# EAGLE schematic basic_schematic_input (EAGLE 9.6.2)
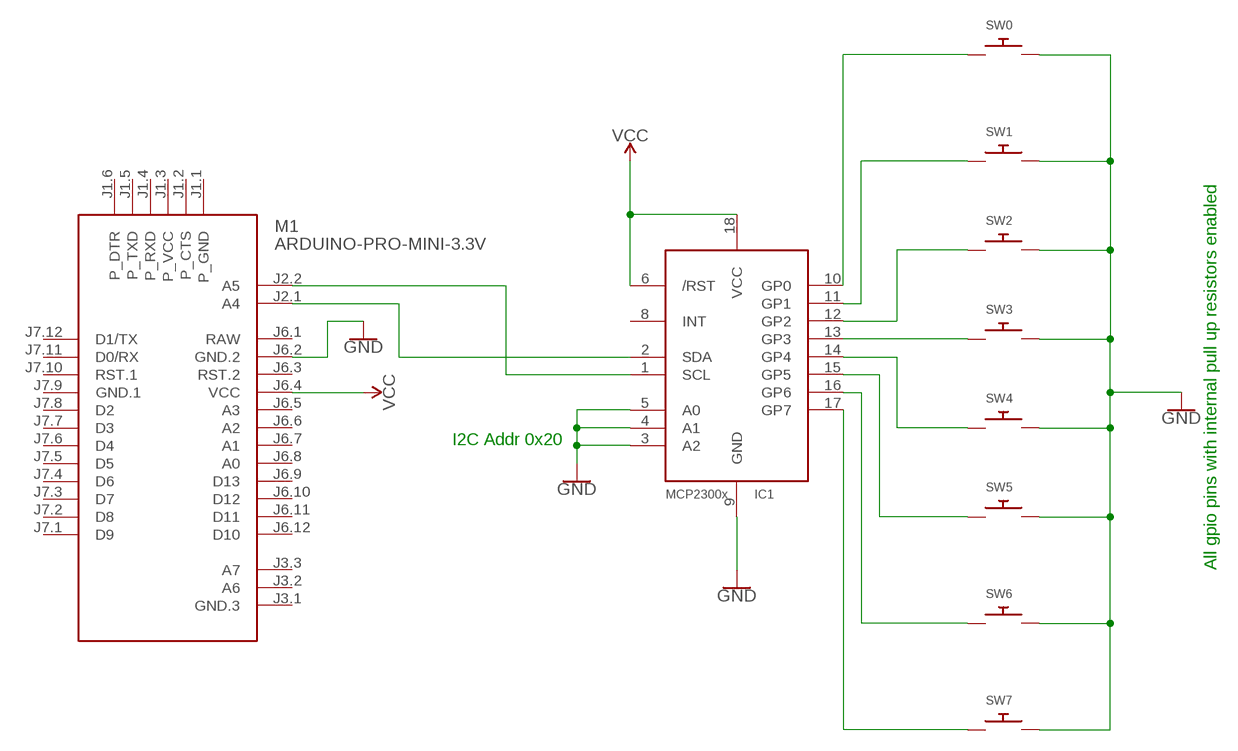
[diagram p0: schematic, sheet 1]

## Parts
IC1  MCP23008/SO  [SO18W]
M1  ARDUINO-PRO-MINI-3.3V  [ARDUINO-PRO-MINI]
SW0  SWITCH_PUSHBUTTONC&K_KSS  [BTN_CK_KSS]
SW1  SWITCH_PUSHBUTTONC&K_KSS  [BTN_CK_KSS]
SW2  SWITCH_PUSHBUTTONC&K_KSS  [BTN_CK_KSS]
SW3  SWITCH_PUSHBUTTONC&K_KSS  [BTN_CK_KSS]
SW4  SWITCH_PUSHBUTTONC&K_KSS  [BTN_CK_KSS]
SW5  SWITCH_PUSHBUTTONC&K_KSS  [BTN_CK_KSS]
SW6  SWITCH_PUSHBUTTONC&K_KSS  [BTN_CK_KSS]
SW7  SWITCH_PUSHBUTTONC&K_KSS  [BTN_CK_KSS]

## Nets
GND: IC1.3(A2) IC1.4(A1) IC1.5(A0) IC1.9(GND) M1.J6.2(GND.2) SW0.P$2 SW1.P$2 SW2.P$2 SW3.P$2 SW4.P$2 SW5.P$2 SW6.P$2 SW7.P$2
N$1: IC1.2(SDA) M1.J2.1(A4)
N$2: IC1.1(SCL) M1.J2.2(A5)
N$3: IC1.13(GP3) SW3.P$1
N$11: IC1.10(GP0) SW0.P$1
N$12: IC1.11(GP1) SW1.P$1
N$13: IC1.12(GP2) SW2.P$1
N$15: IC1.14(GP4) SW4.P$1
N$16: IC1.15(GP5) SW5.P$1
N$17: IC1.16(GP6) SW6.P$1
N$18: IC1.17(GP7) SW7.P$1
VCC: IC1.6(/RST) IC1.18(VCC) M1.J6.4(VCC)
Unconnected: IC1.8(INT) M1.J1.1(P_GND) M1.J1.2(P_CTS) M1.J1.3(P_VCC) M1.J1.4(P_RXD) M1.J1.5(P_TXD) M1.J1.6(P_DTR) M1.J3.1(GND.3) M1.J3.2(A6) M1.J3.3(A7) M1.J6.3(RST.2) M1.J6.5(A3) M1.J6.6(A2) M1.J6.7(A1) M1.J6.8(A0) M1.J6.9(D13) M1.J6.10(D12) M1.J6.11(D11) M1.J6.12(D10) M1.J7.1(D9) M1.J7.2(D8) M1.J7.3(D7) M1.J7.4(D6) M1.J7.5(D5) M1.J7.6(D4) M1.J7.7(D3) M1.J7.8(D2) M1.J7.10(RST.1) M1.J7.11(D0/RX) M1.J7.12(D1/TX)

## Notes on the sheet
- I2C Addr 0x20
- All gpio pins with internal pull up resistors enabled

## Power pins joined to a net without a drawn wire
GND.1: M1.J7.9(GND.1)
RAW: M1.J6.1(RAW)

## Library data of the parts
IC1 = adafruit:MCP23008: MCP23008 Inexpensive i2c i/o expander - 8 general purpose i/o pins with optional pullups
M1 = diy-modules:ARDUINO-PRO-MINI-*: Arduino Pro Mini and compatible devices More details available here: https://www.arduino.cc/en/Main/ArduinoBoardProMini Click here to find device on ebay.com <http://www.ebay.com/sch/arduino+pro+mini>
SW0 SW1-SW7 = adafruit:SWITCH_PUSHBUTTON: Buttons SOFTTOUCHSMD_SJ - Soft touch temporary push button (Super Junk Akihabara) Compatible with SKPMANE010 [Mouser: 688-SKPMAN] C&K_KSS = Digikey: KSS221GLFS